# EasyEDA Pro project Space_Hexapod.eprj, board Signal
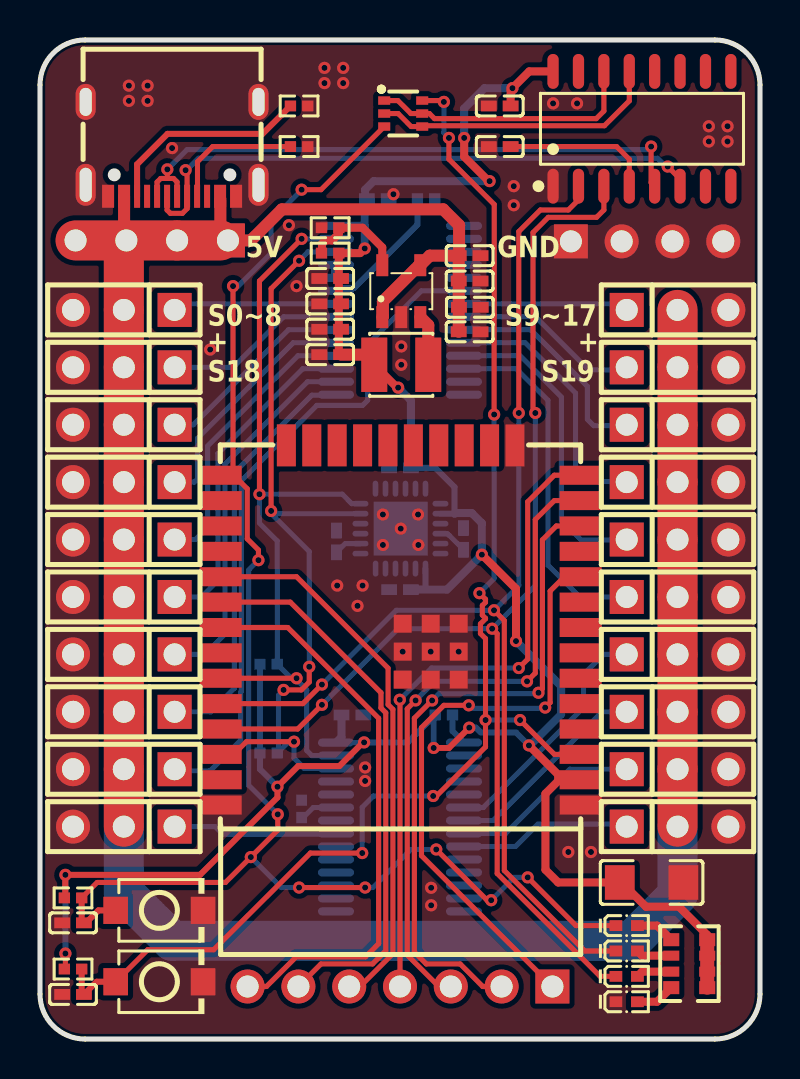
[diagram p2: board, top side]
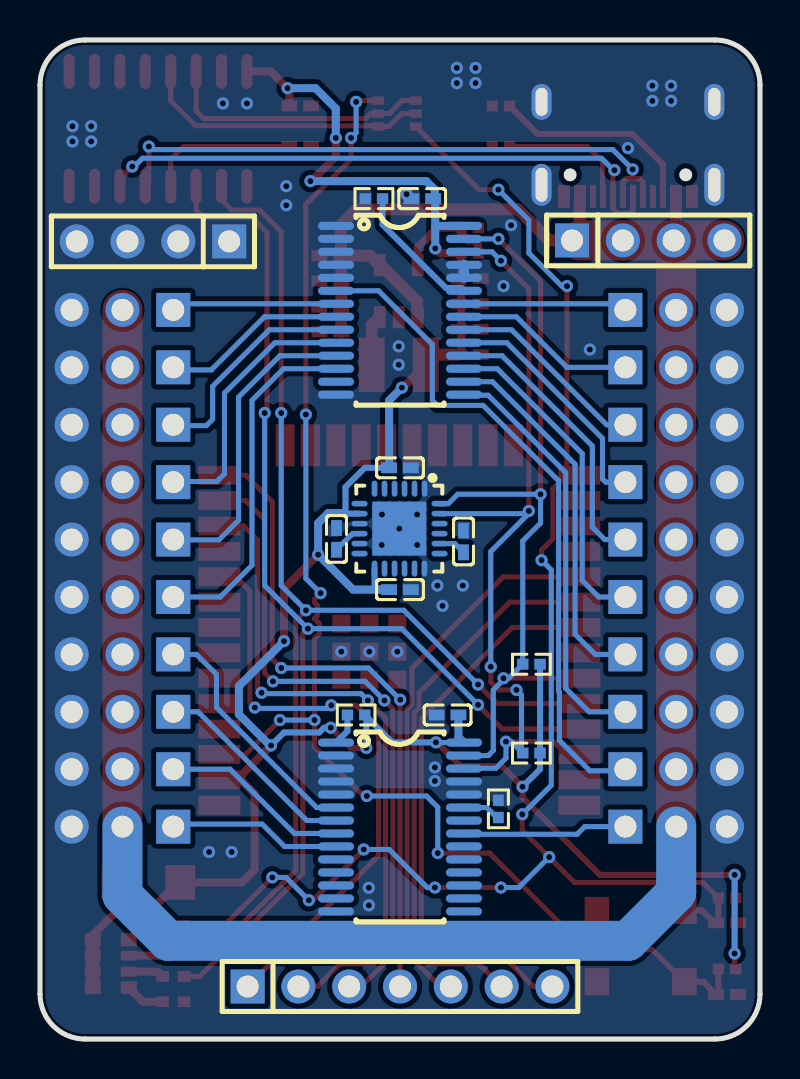
[diagram p3: board, bottom side, seen from below]

Outline 36 x 50 mm; copper layers: Top Layer, Bottom Layer. Coordinates in mm from the lower left corner of the outline.
Outline path: 0,47.75 0,2.25 arc(0.66,0.66) 2.25,0 33.75,0 arc(35.34,0.66) 36,2.25 36,47.75 arc(35.34,49.34) 33.75,50 2.25,50 arc(0.66,49.34) 0,47.75
Stack: Top Layer 0.035mm / Dielectric1 1.51mm FR4 er 4.5 / Bottom Layer 0.035mm

## Design rules (mm)
template: 自定义配置
spacing copperThickness1oz (default): track to track 0.102, other pairs 0.152 to 0.3
spacing copperThickness2oz: track to track 0.203, other pairs 0.152 to 0.3
track width copperThickness1oz (default): min 0.127, default 0.254, max 2.54
track width copperThickness2oz: min 0.203, default 0.254, max 2.54
differential pair differentialPair (default): width min 0.127, default 0.254, max 2.54; gap min 0.152, default 0.152
via viaSize (default): diameter min 0.5, default 0.61, max 10; hole min 0.3, default 0.305, max 6.3

## Placement (name value [footprint] x y rotation side)
3V1  NCD0402G1  [LED0402-RD]  29.33 1.87 0 top
BOOT1  TS-1088-AR02016  [SW-SMD_L3.9-W3.0-P4.45]  5.97 6.44 0 top
BOOT2  NCD0402G1  [LED0402-RD]  29.33 5.68 0 top
C1  10uF  [C0402]  16.89 42.06 180 bottom
C2  1uF  [C0402]  22.99 44.67 0 top
C3  100nF  [C0402]  22.99 46.7 0 top
C4  10uF  [C0402]  15.62 16.22 180 bottom
C9  10uF  [C0402]  14.51 34.25 0 top
C10  100nF  [C0402]  14.51 36.79 0 top
C11  10uF  [C0402]  14.51 35.52 0 top
C12  100nF  [C0402]  14.51 38.06 0 top
C15  2.2nF  [C0402]  14.82 24.9 90 bottom
C16  100uF  [C1206]  30.58 7.84 0 top
C17  10uF  [C0402]  21.49 36.62 180 top
C18  100nF  [C0402]  21.48 39.2 180 top
C19  10uF  [C0402]  21.48 35.39 180 top
C20  100nF  [C0402]  21.48 37.93 180 top
C21  10nF  [C0402]  18 28.59 180 bottom
C22  100nF  [C0402]  21.18 25.03 270 bottom
C23  100nF  [C0402]  18 22.49 0 bottom
C24  100nF  [C0402]  1.65 5.81 0 top
C25  100nF  [C0402]  1.65 2.23 0 top
EN1  TS-1088-AR02016  [SW-SMD_L3.9-W3.0-P4.45]  5.97 2.87 0 top
H1  PZ254V-11-03P  [HDR-TH_3P-P2.54-V-M]  4.19 36.49 180 top
H2  PZ254V-11-03P  [HDR-TH_3P-P2.54-V-M]  4.19 27.87 180 top
H3  PZ254V-11-03P  [HDR-TH_3P-P2.54-V-M]  4.19 19.25 180 top
H4  PZ254V-11-03P  [HDR-TH_3P-P2.54-V-M]  4.19 33.62 180 top
H5  PZ254V-11-03P  [HDR-TH_3P-P2.54-V-M]  4.19 25 180 top
H6  PZ254V-11-03P  [HDR-TH_3P-P2.54-V-M]  4.19 16.38 180 top
H7  PZ254V-11-03P  [HDR-TH_3P-P2.54-V-M]  4.19 30.74 180 top
H8  PZ254V-11-03P  [HDR-TH_3P-P2.54-V-M]  4.19 22.12 180 top
H9  PZ254V-11-03P  [HDR-TH_3P-P2.54-V-M]  4.19 13.5 180 top
H10  PZ254V-11-03P  [HDR-TH_3P-P2.54-V-M]  31.88 36.49 0 top
H11  PZ254V-11-03P  [HDR-TH_3P-P2.54-V-M]  31.88 27.87 0 top
H12  PZ254V-11-03P  [HDR-TH_3P-P2.54-V-M]  31.88 19.25 0 top
H13  PZ254V-11-03P  [HDR-TH_3P-P2.54-V-M]  31.88 33.62 0 top
H14  PZ254V-11-03P  [HDR-TH_3P-P2.54-V-M]  31.88 25 0 top
H15  PZ254V-11-03P  [HDR-TH_3P-P2.54-V-M]  31.88 16.38 0 top
H16  PZ254V-11-03P  [HDR-TH_3P-P2.54-V-M]  31.88 30.74 0 top
H17  PZ254V-11-03P  [HDR-TH_3P-P2.54-V-M]  31.88 22.12 0 top
H18  PZ254V-11-03P  [HDR-TH_3P-P2.54-V-M]  31.88 13.5 0 top
H19  PZ254V-11-03P  [HDR-TH_3P-P2.54-V-M]  4.19 10.63 180 top
H20  PZ254V-11-03P  [HDR-TH_3P-P2.54-V-M]  31.88 10.63 0 top
H25  PZ254V-11-07P  [HDR-TH_7P-P2.54-V-M]  18 2.63 180 bottom
L2  2.2uH  [IND-SMD_L3.0-W3.0_FNR30XXS]  18.06 33.74 180 top
Q1  UMH3N  [SC-70-6_L2.2-W1.3-P0.65-LS2.1-BR]  18.16 46.32 180 top
R2  10kΩ  [R0402]  19.3 42.06 0 bottom
R4  4.7kΩ  [R0402]  20.19 16.22 0 bottom
R5  10kΩ  [R0402]  13.08 11.52 90 bottom
R7  100kΩ  [R0402]  14.51 40.6 0 top
R9  450kΩ  [R0402]  14.51 39.33 0 top
R14  1kΩ  [R0402]  1.65 7.06 0 top
R15  1kΩ  [R0402]  1.65 3.5 0 top
R16  4.7kΩ  [R0402]  11.43 18.76 0 bottom
R17  4.7kΩ  [R0402]  11.43 14.31 0 bottom
R18  5.1kΩ  [R0402]  12.95 44.67 0 top
R19  5.1kΩ  [R0402]  12.95 46.7 0 top
RN1  1kΩ  [RES-ARRAY-SMD_0603-8P-L3.2-W1.6-BL]  32.46 3.77 270 top
RXD1  NCD0402G1  [LED0402-RD]  29.33 4.41 0 top
TXD1  NCD0402G1  [LED0402-RD]  29.33 3.14 0 top
U1  PCA9685PW,118  [TSSOP-28_L9.7-W4.4-P0.65-LS6.4-TL]  18 36.47 180 bottom
U2  CH340C  [SOP-16_L10.0-W3.9-P1.27-LS6.0-BL]  30.1 45.55 0 top
U3  PCA9685PW,118  [TSSOP-28_L9.7-W4.4-P0.65-LS6.4-TL]  18 10.61 180 bottom
U5  TLV62568DBVR  [SOT-23-5_L3.0-W1.7-P0.95-LS2.8-BR]  18.06 37.43 270 top
U6  ESP32-WROOM-32E-N8  [WIFI-SMD_ESP32-WROOM-32E]  18.03 20.71 90 top
U7  MPU-6050  [QFN-24_L4.0-W4.0-P0.50-BL-EP2.7]  18.02 25.54 0 bottom
U8  HX PZ2.54-1x4P ZZ  [HDR-TH_4P-P2.54-V-M]  30.35 39.92 0 bottom
U10  HX PZ2.54-1x4P ZZ  [HDR-TH_4P-P2.54-V-M]  5.59 39.97 180 bottom
USB1  TYPE-C16PIN  [USB-C-SMD_TYPE-C16PIN]  6.6 44.54 180 top

## Footprints (pads in the part's own frame, mm; a bottom-side part is the same pattern mirrored in y, then rotated)
C0402
  rect 0.79x0.54 smd: 1(-0.545,0) 2(0.545,0)
C1206
  rect 1.485x1.728 smd: 1(-1.593,0) 2(1.593,0)
HDR-TH_3P-P2.54-V-M
  rect 1.7x1.7 hole 1.1: 1(-2.54,0)
  round 1.7 hole 1.1: 2(0,0) 3(2.54,0)
HDR-TH_4P-P2.54-V-M
  rect 1.7x1.7 hole 1.1: 1(-3.81,0)
  round 1.7 hole 1.1: 2(-1.27,0) 3(1.27,0) 4(3.81,0)
HDR-TH_7P-P2.54-V-M
  rect 1.7x1.7 hole 1.1: 1(-7.62,0)
  round 1.7 hole 1.1: 2(-5.08,0) 3(-2.54,0) 4(0,0) 5(2.54,0) 6(5.08,0) 7(7.62,0)
IND-SMD_L3.0-W3.0_FNR30XXS
  rect 1.3x2.72 smd: 1(1.35,0) 2(-1.35,0)
LED0402-RD
  rect 0.636x0.54 smd: 1(-0.538,0) 2(0.538,0)
QFN-24_L4.0-W4.0-P0.50-BL-EP2.7
  oval 0.28x0.8 smd: 1(-1.25,-2) 2(-0.75,-2) 3(-0.25,-2) 4(0.25,-2) 5(0.75,-2) 6(1.25,-2) 13(1.25,2) 14(0.75,2) 15(0.25,2) 16(-0.25,2) 17(-0.75,2) 18(-1.242,2)
  oval 0.8x0.28 smd: 7(2,-1.25) 8(2,-0.75) 9(2,-0.25) 10(2,0.25) 11(2,0.75) 12(2,1.25) 19(-2,1.25) 20(-2,0.75) 21(-2,0.25) 22(-2,-0.25) 23(-2,-0.75) 24(-2,-1.25)
  rect 2.7x2.7 smd: 25(0.013,0)
R0402
  rect 0.566x0.54 smd: 1(-0.433,0) 2(0.433,0)
RES-ARRAY-SMD_0603-8P-L3.2-W1.6-BL
  rect 0.65x0.8 smd: 1(-1.2,-0.9) 4(1.2,-0.9) 5(1.2,0.9) 8(-1.2,0.9)
  rect 0.5x0.8 smd: 2(-0.4,-0.9) 3(0.4,-0.9) 6(0.4,0.9) 7(-0.4,0.9)
SC-70-6_L2.2-W1.3-P0.65-LS2.1-BR
  rect 0.6x0.42 smd: 1(0.95,-0.65) 2(0.95,0) 3(0.95,0.65) 4(-0.95,0.65) 5(-0.95,0) 6(-0.95,-0.65)
SOP-16_L10.0-W3.9-P1.27-LS6.0-BL
  oval 0.56x1.745 smd: 1(-4.445,-2.873) 2(-3.175,-2.873) 3(-1.905,-2.873) 4(-0.635,-2.873) 5(0.635,-2.873) 6(1.905,-2.873) 7(3.175,-2.873) 8(4.445,-2.873) 9(4.445,2.873) 10(3.175,2.873) 11(1.905,2.873) 12(0.635,2.873) 13(-0.635,2.873) 14(-1.905,2.873) 15(-3.175,2.873) 16(-4.445,2.873)
SOT-23-5_L3.0-W1.7-P0.95-LS2.8-BR
  rect 1.1x0.6 smd: 1(1.3,-0.95) 2(1.3,0) 3(1.3,0.95) 4(-1.3,0.95) 5(-1.3,-0.95)
SW-SMD_L3.9-W3.0-P4.45
  rect 1.23x1.36 smd: 1(-2.185,0) 2(2.185,0)
TSSOP-28_L9.7-W4.4-P0.65-LS6.4-TL
  oval 1.804x0.406 smd: 1(-3.2,4.225) 2(-3.2,3.575) 3(-3.2,2.925) 4(-3.2,2.275) 5(-3.2,1.625) 6(-3.2,0.975) 7(-3.2,0.325) 8(-3.2,-0.325) 9(-3.2,-0.975) 10(-3.2,-1.625) 11(-3.2,-2.275) 12(-3.2,-2.925) 13(-3.2,-3.575) 14(-3.2,-4.225) 15(3.2,-4.225) 16(3.2,-3.575) 17(3.2,-2.925) 18(3.2,-2.275) 19(3.2,-1.625) 20(3.2,-0.975) 21(3.2,-0.325) 22(3.2,0.325) 23(3.2,0.975) 24(3.2,1.625) 25(3.2,2.275) 26(3.2,2.925) 27(3.2,3.575) 28(3.2,4.225)
USB-C-SMD_TYPE-C16PIN
  oval 1x2.1 hole 0.6x1.7: 1(-4.32,1.788) 2(4.32,1.788)
  oval 1x1.8 hole 0.6x1.4: 3(-4.32,-2.362) 4(4.32,-2.362)
  rect 0.6x1.15 smd: A1B12(-3.2,2.362) A4B9(-2.4,2.362) B1A12(3.2,2.362) B4A9(2.4,2.362)
  rect 0.3x1.15 smd: A5(-1.25,2.362) A6(-0.25,2.362) A7(0.25,2.362) A8(1.25,2.362) B5(1.75,2.362) B6(0.75,2.362) B7(-0.75,2.362) B8(-1.75,2.362)
WIFI-SMD_ESP32-WROOM-32E
  rect 0.95x2.1 smd: 1(-9.002,-9) 2(-7.732,-9) 3(-6.463,-9) 4(-5.192,-9) 5(-3.922,-9) 6(-2.652,-9) 7(-1.383,-9) 8(-0.113,-9) 9(1.157,-9) 10(2.428,-9) 11(3.697,-9) 12(4.968,-9) 13(6.237,-9) 14(7.508,-9) 25(7.508,9) 26(6.237,9) 27(4.968,9) 28(3.697,9) 29(2.428,9) 30(1.157,9) 31(-0.113,9) 32(-1.383,9) 33(-2.652,9) 34(-3.922,9) 35(-5.192,9) 36(-6.463,9) 37(-7.732,9) 38(-9.002,9)
  rect 2.1x0.95 smd: 15(9.002,-5.715) 16(9.002,-4.445) 17(9.002,-3.175) 18(9.002,-1.905) 19(9.002,-0.635) 20(9.002,0.635) 21(9.002,1.905) 22(9.002,3.175) 23(9.002,4.445) 24(9.002,5.715)
  rect 0.9x0.9 smd: 39(-2.721,-0.1) 39(-2.721,-1.5) 39(-2.721,-2.9) 39(-1.321,-0.1) 39(-1.321,-1.5) 39(-1.321,-2.9) 39(0.079,-0.1) 39(0.079,-1.5) 39(0.079,-2.9)

## Nets
As in the schematic.

Pads without a net: U1 13; U2 7 8 9 10 11 12 15; U3 10 11 12 13 15 16 17 18 19 20 22; U6 4 5 6 7 8 9 11 16 17 18 19 20 21 22 23 24 26 27 28 32 37; U7 2 3 4 5 6 7 12 14 15 16 17 19 21 22; USB1 A8 B8

## Via types
v1: diameter 0.61, hole 0.305, Top Layer to Bottom Layer, 98 vias

## Routing (per net, layer and track width the routed paths; a pad name or vN(x,y) marks a point on that pad's centre or on a via; arc(x,y) is an arc through that point)
3V3: length 126
  Top Layer w0.254: R15.1 1.27,3.55 v1(1.27,4.28) ; 1.27,7.11 R14.1
  Top Layer w0.3: v1(19.69,14.57) 20.45,14.57 v1(21.46,15.58) ; v1(16.21,14.85) 16.15,14.85 14.97,13.66 12.91,13.66 v1(11.87,12.63) 11.87,12.09 8,8.22 v1(1.27,8.22) 1.26,8.21 1.26,7.12 1.27,7.11
  Top Layer w0.4: v1(16.24,39.57) 16,39.33 R9.2 14.94,34.36 C9.2 ; v1(17.91,32.6) 17.86,32.6 L2.1 ; RN1.8 33.36,5.21 31.95,6.62 30.3,6.62 29.08,7.84 C16.1 25.91,7.84 25.27,8.47 25.27,12.28 25.91,12.92 ; v1(22.09,24.24) 23.8,22.53 v1(23.8,19.91) ; U6.2 26.97,12.92 25.91,12.92 ; 25.91,12.92 25.91,13.23 v1(24.45,14.69) ; v1(22.48,42.94) 22.43,42.94 21.21,44.16 v1(21.21,45.1) ; U2.16 24.46,48.43 v1(23.62,47.59) 23.53,47.5 C3.2
  Top Layer w0.6: L2.1 16.21,34.25 C9.2
  Top Layer w0.7: RN1.8 RN1.7 RN1.6 RN1.5
  Bottom Layer w0.254: v1(16.21,14.85) 16.19,14.84 U3.28
  Bottom Layer w0.3: U7.13 19.27,22.54 18.6,22.54 C23.2 ; R16.1 R17.1 11,13.5 v1(11.87,12.63) ; 19.69,16.14 v1(19.69,14.57) ; 19.69,16.14 R4.1 ; 19.69,16.14 18.39,14.85 v1(16.21,14.85) ; U7.8 20.73,26.29 20.73,27.62 19.76,28.59 C21.1 ; v1(24.45,14.69) 23.8,15.34 22.04,15.34 21.8,15.58 v1(21.46,15.58) ; v1(1.27,4.28) v1(1.27,8.22)
  Bottom Layer w0.4: 16.24,40.7 16.24,41.95 ; 16.24,40.7 v1(16.24,39.57) ; 16.24,40.7 U1.28 ; C4.2 15.08,15.11 U3.28 ; v1(23.8,19.91) 26.06,17.66 26.06,16.25 24.5,14.69 v1(24.45,14.69) ; v1(22.48,42.94) 16.69,42.94 16.26,42.51 16.26,42.11 16.32,42.04 ; 20.73,26.29 20.73,26.29 20.76,26.32 21.59,26.32 22.09,25.82 v1(22.09,24.24) 20.35,22.49 C23.2 ; v1(17.91,32.6) 18.54,31.96 C21.1 ; v1(23.62,47.59) 22.22,47.59 21.21,46.57 v1(21.21,45.1)
5V: length 126
  Top Layer w0.6: U10.1 10.54,39.97 12.1,41.52 20.16,41.52 20.96,40.73 20.96,39.22 C18.2 ; C19.2 C20.2 C18.2 ; 9.02,39.97 9.02,42.03 ; 4.2,40.08 USB1.B4A9 ; C18.2 19.49,39.2 U5.4 18.95,38.73 17.15,36.92 17.15,36.16 U5.1
  Top Layer w2: H19.2 H9.2 H6.2 H3.2 H8.2 H5.2 H2.2 H7.2 H4.2 H1.2 4.19,39.59 ; H20.2 H18.2 H15.2 H12.2 H17.2 H14.2 H11.2 H16.2 H13.2 H10.2 ; 9.02,39.97 U10.2 U10.3 U10.4
  Bottom Layer w2: H20.2 31.88,7.2 29.59,4.91 6.6,4.91 4.19,7.33 H19.2
GND: length 0.6
  Bottom Layer w0.5: U1.24 14.8,38.75
  vias: v1(4.44,47.71) v1(4.44,46.95) v1(5.38,47.71) v1(5.38,46.95) v1(6.6,44.59) v1(8.51,34.51) v1(12.45,40.73) v1(12.83,37.68) v1(14.22,48.6) v1(14.22,47.84) v1(14.86,22.69) v1(15.16,48.6) v1(15.16,47.84) v1(15.88,21.68) v1(16.13,22.69) v1(16.26,13.59) v1(16.26,12.92) v1(17.15,26.25) v1(17.15,24.73) v1(17.67,42.28) v1(18.04,25.54) v1(18.06,34.66) v1(18.06,33.74) v1(18.13,19.39) v1(18.9,26.25) v1(18.92,24.73) v1(19.53,19.39) v1(19.56,7.57) v1(19.56,6.69) v1(20.93,19.39) v1(23.69,42.68) v1(23.69,41.73) v1(25.65,46.82) v1(26.42,9.36) v1(26.85,46.82) v1(27.55,9.36) v1(33.44,45.68) v1(33.44,44.92) v1(34.38,45.68) v1(34.38,44.92)
BOOT: length 77.6
  Top Layer w0.254: v1(19.81,9.49) 22.35,6.95 v1(22.56,6.95) ; R14.2 2.86,7.84 9.27,7.84 v1(10.54,9.11) 11.89,10.45 v1(11.89,11.25) ; v1(10.92,23.96) 10.92,24.47 10.36,25.03 10.36,27.54 9.68,28.22 9.65,28.22 ; v1(13.08,42.51) 14.05,42.51 Q1.3 ; v1(16.26,7.58) v1(12.95,7.58) ; BOOT2.1 26.8,5.68 v1(24.38,8.09) ; v1(9.65,37.68) 9.65,28.22 ; 9.65,28.22 U6.25
  Top Layer w0.3: R14.2 2.08,5.93 C24.2 2.3,5.81 2.92,6.44 BOOT1.1
  Bottom Layer w0.254: v1(19.81,9.49) 18.54,9.49 16.64,7.58 v1(16.26,7.58) ; v1(13.08,42.51) 11.56,40.98 11.56,39.33 9.91,37.68 v1(9.65,37.68) ; v1(22.56,6.95) 23.7,8.09 v1(24.38,8.09) ; v1(11.89,11.25) 10.44,12.7 10.44,23.48 v1(10.92,23.96) ; v1(12.95,7.58) 12.06,7.58 v1(10.54,9.11)
D+: length 29.7
  Top Layer w0.254: v1(30.56,44.66) 30.56,42.86 U2.5 ; 6.37,43.07 v1(6.37,43.52) ; 6.37,43.07 6.68,43.07 6.85,42.89 USB1.A6 ; 6.37,43.07 6.03,43.07 5.85,42.89 USB1.B6
  Bottom Layer w0.254: v1(30.56,44.66) 30.41,44.51 7.36,44.51 v1(6.37,43.52)
D-: length 29.6
  Top Layer w0.254: U2.6 32,43.05 v1(31.38,43.67) ; USB1.A7 6.35,41.49 6.52,41.32 7.12,41.32 7.35,41.56 USB1.B7 7.35,43.41 v1(7.28,43.48)
  Bottom Layer w0.254: v1(7.28,43.48) 7.33,43.48 7.92,44.08 30.87,44.08 31.29,43.67 v1(31.38,43.67)
DTR: length 14.5
  Top Layer w0.254: Q1.2 17.91,46.32 18.56,45.67 Q1.4 19.15,45.71 28.22,45.71 29.46,46.95 U2.13
EN: length 68.5
  Top Layer w0.254: v1(21.97,22.31) 22.28,22.01 22.28,21.86 22.12,21.7 22.12,21.21 22.28,21.06 22.28,21.03 22.02,20.78 22.02,20.29 22.28,20.04 v1(22.28,15.96) 22.28,14.62 19.82,12.16 v1(19.66,12.16) ; U6.3 25.72,14.25 v1(24,15.96) ; v1(20.45,45.1) 20.45,44.03 22.71,41.77 22.71,36.23 22.71,36.23 v1(22.71,31.25) ; 19.11,46.97 20.13,46.97 v1(20.19,46.9) ; EN1.1 5.39,4.47 8.68,4.47 13.52,9.31 v1(16.11,9.31)
  Top Layer w0.3: R15.2 2.08,2.34 C25.2 2.83,2.87 EN1.1
  Bottom Layer w0.254: v1(20.19,46.9) 20.19,45.35 v1(20.45,45.1) ; v1(21.97,22.31) 22.71,23.05 v1(22.71,31.25) ; v1(16.11,9.31) 16.11,11.6 16.68,12.16 v1(19.66,12.16) ; v1(22.28,15.96) v1(24,15.96)
IO5: length 27.5
  Top Layer w0.254: H25.5 16,2.63 17.64,4.27 17.64,16.5 17.41,16.74 17.41,18.56 12.83,23.14 U6.29
IO12: length 32.7
  Top Layer w0.254: v1(23.94,18.57) 24.38,19.01 24.38,26.89 25.71,28.22 U6.14 ; H25.4 18,16.97 v1(17.99,16.98)
  Bottom Layer w0.254: v1(23.94,18.57) 19.58,18.57 v1(17.99,16.98)
IO14: length 32.6
  Top Layer w0.254: v1(18.78,16.94) 18.36,16.53 18.36,4.21 19.94,2.63 H25.3 ; U6.13 25.71,26.95 24.76,26 24.76,18.32 v1(24.35,17.9)
  Bottom Layer w0.254: v1(18.78,16.94) 19.74,17.9 v1(24.35,17.9)
IO18: length 28
  Top Layer w0.254: U6.30 12.51,21.87 17.05,17.33 17.05,16.57 17.29,16.33 17.29,4.42 16.63,3.76 14.05,3.76 H25.6
IO19: length 28.5
  Top Layer w0.254: H25.7 11.32,2.63 12.81,4.11 16.27,4.11 16.93,4.77 16.93,16.05 12.39,20.6 U6.31
IO25: length 30.2
  Top Layer w0.254: v1(21.44,16.7) 20.19,16.7 19.07,15.58 19.07,9.17 H25.1 ; U6.10 26.22,23.14 25.51,22.42 25.51,16.84 v1(25.26,16.59)
  Bottom Layer w0.254: v1(21.44,16.7) 21.59,16.55 25.22,16.55 v1(25.26,16.59)
IO27: length 33.4
  Top Layer w0.254: H25.2 22.14,2.63 21.01,3.76 19.31,3.76 18.72,4.35 18.72,16.06 v1(19.61,16.94) ; U6.12 25.82,25.68 25.12,24.98 25.12,17.53 v1(24.92,17.33)
  Bottom Layer w0.254: v1(24.92,17.33) 24.88,17.28 19.95,17.28 v1(19.61,16.94)
RTS: length 13.5
  Top Layer w0.254: U2.14 28.19,46.44 27.81,46.06 19.72,46.06 19.47,46.32 Q1.5 18.54,46.32 17.89,46.97 17.21,46.97
SCL: length 41.7
  Top Layer w0.254: v1(11.56,26.43) 11.56,37.55 v1(12.95,38.95) ; v1(12.18,17.47) 13.07,17.47 13.46,17.86 v1(13.46,18.63) ; U6.36 9.68,14.25 10.32,14.88 v1(12.7,14.88)
  Bottom Layer w0.254: v1(13.46,18.63) 13.46,24.4 11.57,26.29 ; 11.57,26.29 11.57,26.42 v1(11.56,26.43) ; 11.57,26.29 U7.23 ; 11.93,14.38 11.93,17.22 v1(12.18,17.47) ; 11.93,14.38 R17.2 ; 11.93,14.38 12.43,14.88 v1(12.7,14.88) 12.7,14.06 13.21,13.55 14.79,13.55 U3.26 ; U1.26 13.4,39.4 v1(12.95,38.95)
SDA: length 39.9
  Top Layer w0.254: U6.33 v1(12.83,18.06) ; v1(10.97,27.27) 10.97,37.94 v1(13.08,40.05)
  Bottom Layer w0.254: 14.8,40.05 v1(13.08,40.05) ; U3.27 13.59,14.19 13.34,14.44 13.34,17.47 12.83,17.98 v1(12.83,18.06) 12.56,18.06 R16.2 11.86,24.93 10.97,25.82 v1(10.97,27.27) 15.11,27.27 15.59,26.79 U7.24
SERVO0: length 8.2
  Bottom Layer w0.254: H1.1 6.89,36.49 7.2,36.8 U1.22
SERVO1: length 9.1
  Bottom Layer w0.254: H4.1 9.65,33.62 12.18,36.15 U1.21
SERVO2: length 10
  Bottom Layer w0.254: H7.1 7.67,30.74 12.42,35.5 U1.20
SERVO3: length 12.1
  Bottom Layer w0.254: H2.1 7.72,27.87 7.87,28.03 7.87,30.06 12.66,34.85 U1.19
SERVO4: length 14.3
  Bottom Layer w0.254: H5.1 7.76,25 8.38,25.62 8.38,29.68 12.9,34.2 U1.18
SERVO5: length 16.5
  Bottom Layer w0.254: 14.8,33.55 13.14,33.55 8.89,29.3 8.89,22.95 8.06,22.12 H8.1
SERVO6: length 18.7
  Bottom Layer w0.254: U1.16 13.38,32.9 9.25,28.77 9.25,20.26 8.24,19.25 H3.1
SERVO7: length 21
  Bottom Layer w0.254: H6.1 8.54,16.38 9.72,17.55 9.72,28.35 13.59,32.22 14.77,32.22 14.8,32.25
SERVO8: length 33.7
  Bottom Layer w0.254: H9.1 6.81,13.42 8.51,13.42 10.03,14.95 10.03,17.37 10.07,17.4 10.07,27.94 13.84,31.71 16.13,31.71 16.38,31.97 16.38,34.76 19.07,37.45 U1.6
SERVO9: length 8.3
  Bottom Layer w0.254: 29.34,36.49 29.03,36.8 U1.7
SERVO10: length 9.3
  Bottom Layer w0.254: U1.8 24.78,36.15 27.43,33.49 29.21,33.49 29.34,33.62
SERVO11: length 11.1
  Bottom Layer w0.254: U1.9 24.54,35.5 27.37,32.66 27.37,31.01 27.69,30.7 29.29,30.7 29.34,30.74
SERVO12: length 13.4
  Bottom Layer w0.254: U1.10 24.26,34.85 26.78,32.33 26.78,28.28 27.16,27.9 29.31,27.9 29.34,27.87
SERVO13: length 15.6
  Bottom Layer w0.254: U1.11 24,34.2 26.07,32.13 26.07,25.96 27.05,24.98 29.32,24.98 29.34,25
SERVO14: length 17.7
  Bottom Layer w0.254: 21.2,33.55 23.82,33.55 25.4,31.97 25.4,23.71 26.99,22.12 29.34,22.12
SERVO15: length 12.3
  Bottom Layer w0.254: U3.6 22.17,11.59 27.18,16.6 27.18,18.25 28.18,19.25 29.34,19.25
SERVO16: length 10.4
  Bottom Layer w0.254: 29.34,16.38 28.1,16.38 22.66,10.94 U3.7
SERVO17: length 9.5
  Bottom Layer w0.254: 29.34,13.5 26.5,13.5 23.28,10.29 U3.8
SERVO18: length 8.4
  Bottom Layer w0.254: H19.1 6.93,10.43 7.29,10.43 7.49,10.63 8.76,10.63 9.14,10.25 14.76,10.25 U3.21
SERVO19: length 8.7
  Bottom Layer w0.254: U3.9 23.77,9.64 24.89,10.76 29.21,10.76 29.34,10.63
U0_RXD: length 59.9
  Top Layer w0.254: v1(22.7,21.46) 23.22,20.94 23.22,8.43 27.24,4.41 RXD1.1 ; v1(14.1,17.74) 13.14,16.79 U6.34 ; v1(23.94,31.33) 23.94,40.41 25.02,41.49 26.42,41.49 26.92,42 U2.2
  Bottom Layer w0.254: v1(23.94,31.33) 23.94,22.7 v1(22.7,21.46) 17.81,21.46 v1(14.1,17.74)
U0_TXD: length 62
  Top Layer w0.254: U2.3 28.19,41.49 27.83,41.12 25.41,41.12 24.65,40.36 24.65,31.45 v1(24.76,31.33) ; v1(22.61,20.54) 22.86,20.28 22.86,8.28 28.01,3.14 TXD1.1 ; v1(14.1,16.73) 12.89,15.52 U6.35
  Bottom Layer w0.254: v1(24.76,31.33) 24.76,22.69 v1(22.61,20.54) 17.91,20.54 v1(14.1,16.73)
$3N156124: length 1.4
  Bottom Layer w0.254: U7.20 15.26,24.79 C15.1
$3N156137: length 1.5
  Bottom Layer w0.254: C22.2 21.18,24.49 20.46,25.21 20.45,25.21 20.37,25.29 U7.10
$3N156225: length 6.7
  Bottom Layer w0.3: U1.23 14.94,37.59 15.71,37.59 18.87,40.75 R2.1
$3N156237: length 10.5
  Top Layer w0.3: USB1.B5 4.85,43.78 6.38,45.3 11.12,45.3 12.52,46.7
$3N156249: length 7.5
  Top Layer w0.254: U2.4 29.46,44.03 28.83,44.67 C2.2
$3N156259: length 6.7
  Top Layer w0.254: USB1.A5 7.87,42.2 7.87,43.9 8.64,44.67 12.52,44.67
$3N156261: length 1.9
  Bottom Layer w0.254: U3.23 13.66,11.59 13.16,11.09 R5.1
$3N160361: length 5.3
  Top Layer w0.4: R9.1 14.1,39.35 14.1,39.79 14.27,39.97 14.6,39.97 14.94,40.3 R7.2 16.13,40.6 17.11,39.62 U5.5
$3N160490: length 2.5
  Top Layer w0.6: L2.2 19.41,35.73 U5.3
$3N161793: length 1.6
  Bottom Layer w0.3: R4.2 20.63,15.41 U3.1
$3N172933: length 2
  Top Layer w0.4: 3V1.2 30.86,1.87 RN1.4
$3N172966: length 1.8
  Top Layer w0.4: RN1.3 30.11,3.37 TXD1.2
$3N172969: length 2
  Top Layer w0.4: BOOT2.2 30.86,5.68 RN1.1
$3N173003: length 1.8
  Top Layer w0.4: RN1.2 30.11,4.17 RXD1.2

## Copper pours and planes (outline as drawn; the poured copper is in the pictures)
GND on Top Layer: -2.29,53.94 45.34,53.94 45.34,-3.09 -2.29,-3.09
GND on Bottom Layer: -6.6,52.54 37.08,52.54 37.08,-2.71 -6.6,-2.71

## Text on the board
Top Silkscreen Layer: + | S0~8 | S18 | 5V | GND | S9~17 | S19
